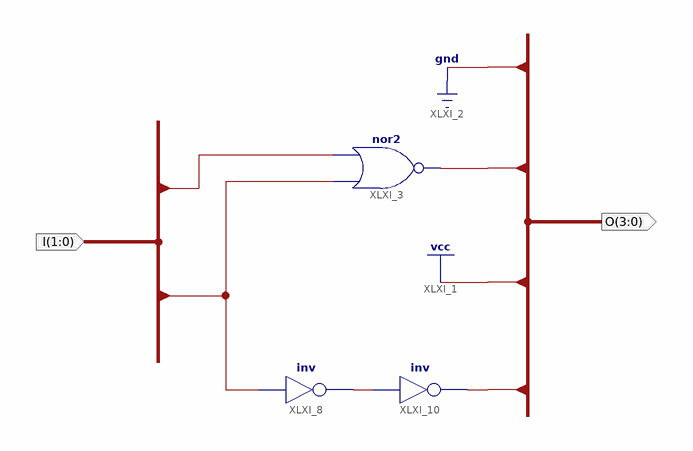
[diagram p0: schematic sheet 1]
// Xilinx ISE schematic ParameterToValue.sch (spartan6) as structural Verilog: 3 symbols, 2 ports
module ParameterToValue (
  input  [1:0] I,
  output [3:0] O
);

  wire XLXN_34;

  nor XLXI_3 (O[2], I[0], I[1]);
  not XLXI_10 (O[0], XLXN_34);
  not XLXI_8 (XLXN_34, I[0]);

  assign {O[3], O[1]} = 2'b01;
endmodule
